# EAGLE schematic v1 (EAGLE 6.5.0)
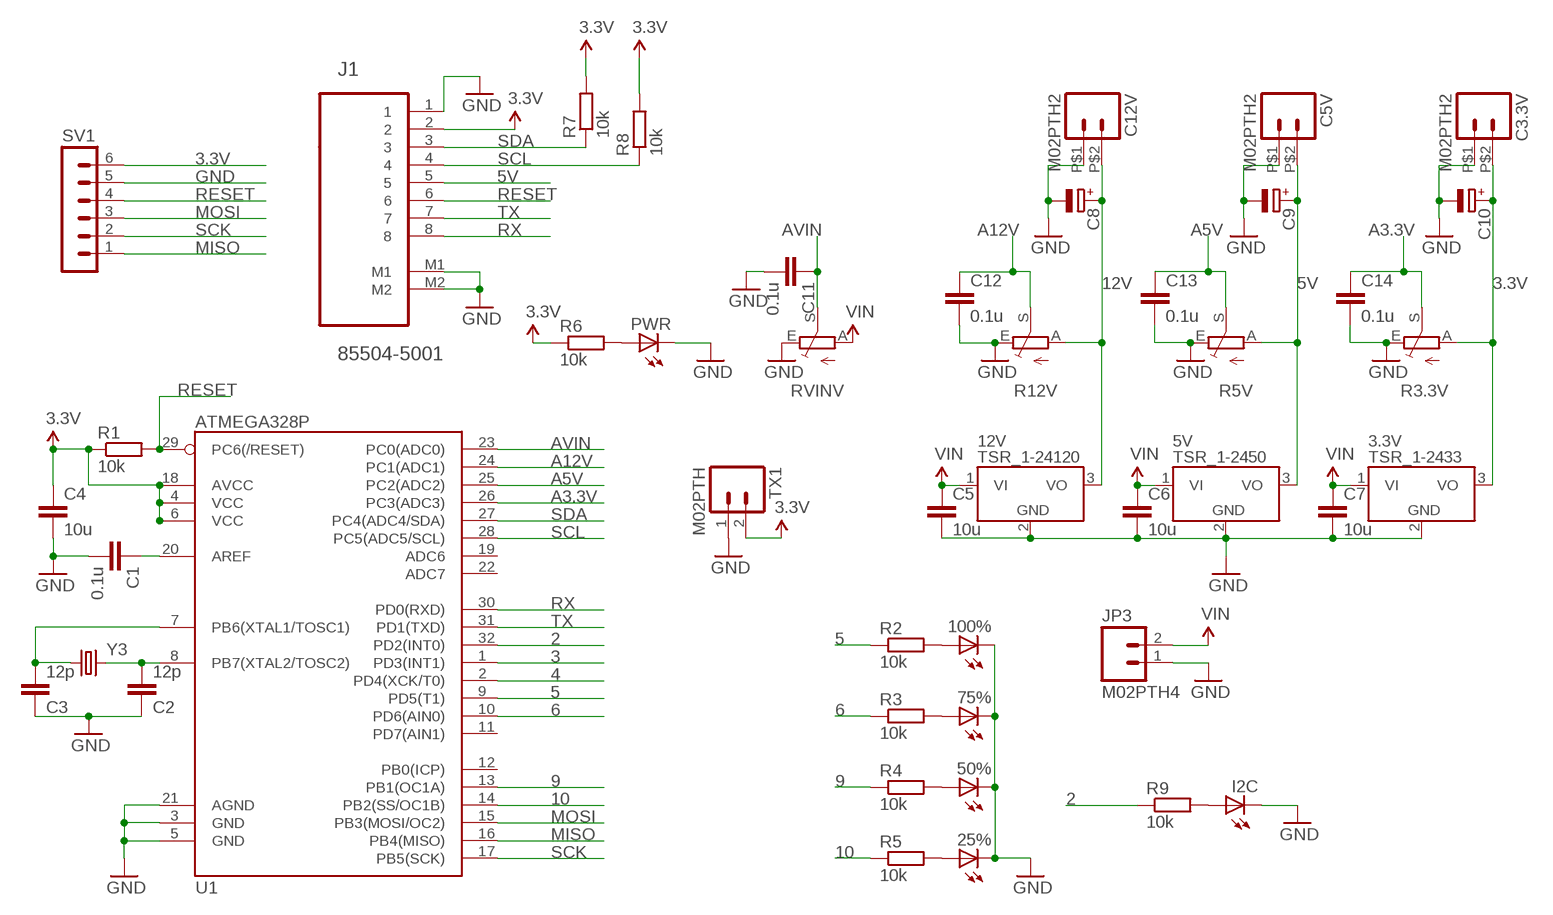
[diagram p0: schematic, sheet 1]

## Parts
3.3V  TSR_1-2433  [TSR-1]
5V  TSR_1-2450  [TSR-1]
12V  TSR_1-24120  [TSR-1]
25%  LEDSML0805  [SML0805]
50%  LEDSML0805  [SML0805]
75%  LEDSML0805  [SML0805]
100%  LEDSML0805  [SML0805]
C1  0.1u  C-EUC0805  [C0805]
C2  12p  C-EUC0805  [C0805]
C3  12p  C-EUC0805  [C0805]
C3.3V  M02PTH2  [1X02_BIG]
C4  10u  C-EUC0805  [C0805]
C5  10u  C-EUC0805  [C0805]
C5V  M02PTH2  [1X02_BIG]
C6  10u  C-EUC0805  [C0805]
C7  10u  C-EUC0805  [C0805]
C8  CPOL-EUE3.5-8  [E3,5-8]
C9  CPOL-EUE3.5-8  [E3,5-8]
C10  CPOL-EUE3.5-8  [E3,5-8]
C11  0.1u  C-EUC0805  [C0805]
C12  0.1u  C-EUC0805  [C0805]
C12V  M02PTH2  [1X02_BIG]
C13  0.1u  C-EUC0805  [C0805]
C14  0.1u  C-EUC0805  [C0805]
I2C  LEDSML0805  [SML0805]
J1  85504-5001  [MOLEX_85504-5001]
JP3  M02PTH4  [1X02_XTRA_BIG]
PWR  LEDSML0805  [SML0805]
R1  10k  R-EU_R0805  [R0805]
R2  10k  R-EU_R0805  [R0805]
R3  10k  R-EU_R0805  [R0805]
R3.3V  TRIM_EU-B64W  [B64W]
R4  10k  R-EU_R0805  [R0805]
R5  10k  R-EU_R0805  [R0805]
R5V  TRIM_EU-B64W  [B64W]
R6  10k  R-EU_R0805  [R0805]
R7  10k  R-EU_R0805  [R0805]
R8  10k  R-EU_R0805  [R0805]
R9  10k  R-EU_R0805  [R0805]
R12V  TRIM_EU-B64W  [B64W]
RVINV  TRIM_EU-B64W  [B64W]
SV1  MA06-1  [MA06-1]
TX1  M02PTH  [1X02]
U1  ATMEGA328P  ATMEGA328_SMT  [TQFP32-08]
Y3  CRYSTALCRYSTAL-SMD-5X3-LARGEPAD  [CRYSTAL-SMD-5X3]

## Nets
2: R9.1 U1.32(PD2(INT0))
3: U1.1(PD3(INT1))
3.3V: 3.3V.3(VO) C3.3V.P$2 C4.1 C10.+ J1.2 R1.1 R3.3V.A R6.1 R7.2 R8.2 SV1.6 TX1.2 U1.4(VCC) U1.6(VCC) U1.18(AVCC)
4: U1.2(PD4(XCK/T0))
5: R2.1 U1.9(PD5(T1))
5V: 5V.3(VO) C5V.P$2 C9.+ J1.5 R5V.A
6: R3.1 U1.10(PD6(AIN0))
9: R4.1 U1.13(PB1(OC1A))
10: R5.1 U1.14(PB2(SS/OC1B))
12V: 12V.3(VO) C8.+ C12V.P$2 R12V.A
A3.3V: C14.1 R3.3V.S U1.26(PC3(ADC3))
A5V: C13.1 R5V.S U1.25(PC2(ADC2))
A12V: C12.1 R12V.S U1.24(PC1(ADC1))
AVIN: C11.1 RVINV.S U1.23(PC0(ADC0))
GND: 3.3V.2(GND) 5V.2(GND) 12V.2(GND) 25%.C 50%.C 75%.C 100%.C C1.2 C2.1 C3.1 C3.3V.P$1 C4.2 C5.2 C5V.P$1 C6.2 C7.2 C8.- C9.- C10.- C11.2 C12.2 C12V.P$1 C13.2 C14.2 I2C.C J1.1 J1.M1 J1.M2 JP3.1 PWR.C R3.3V.E R5V.E R12V.E RVINV.E SV1.5 TX1.1 U1.3(GND) U1.5(GND) U1.21(AGND)
MISO: SV1.1 U1.16(PB4(MISO))
MOSI: SV1.3 U1.15(PB3(MOSI/OC2))
N$1: C1.1 U1.20(AREF)
N$2: I2C.A R9.2
N$3: C2.2 U1.8(PB7(XTAL2/TOSC2)) Y3.3
N$4: C3.2 U1.7(PB6(XTAL1/TOSC1)) Y3.1
N$7: 100%.A R2.2
N$8: 75%.A R3.2
N$9: 50%.A R4.2
N$10: 25%.A R5.2
N$11: PWR.A R6.2
RESET: J1.6 R1.2 SV1.4 U1.29(PC6(/RESET))
RX: J1.8 U1.30(PD0(RXD))
SCK: SV1.2 U1.17(PB5(SCK))
SCL: J1.4 R8.1 U1.28(PC5(ADC5/SCL))
SDA: J1.3 R7.1 U1.27(PC4(ADC4/SDA))
TX: J1.7 U1.31(PD1(TXD))
VIN: 3.3V.1(VI) 5V.1(VI) 12V.1(VI) C5.1 C6.1 C7.1 JP3.2 RVINV.A
Unconnected: U1.11(PD7(AIN1)) U1.12(PB0(ICP)) U1.19(ADC6) U1.22(ADC7)

## Library data of the parts
3.3V 5V 12V = _traco_tsr-1:TSR_1-*: TRACO TSR-1 Series Point-of-Load DC/DC-Converters Vi max. 36 V; Vo = (1.2 .. 15)V ±2%; Io = 0 .. 1 A SIP-Package (drop-in replacement for 78xx linear voltage regulators in TO220-package, vertically assembled) Source: www.tracopower.com Technologies: TSR 1- Vi (V) Vo (V) ±2% Io = 0 .. 1 A 24_ ( generic ) 2412 4.6 .. 36 1.2 2415 4.6 .. 36 1.5 2418 4.6 .. 36 1.8 2425 4.6 .. 36 2.5 2433 4.75.. 36 3.3 2450 6.5 .. 36 5.0 2465 9.0 .. 36 6.5 2490 12 .. 36 9.0 24120 15 .. 36 12 24150 18 .. 36 15 Author: Dipl.-Ing. FH Rainer Bayer HHN Hochschule Heilbronn, rainer.bayer@hs-heilbronn.de Ingenieurbüro ing-rb, mail@ing-rb.de
25% 50% 75% 100% I2C PWR = led:LED: LED OSRAM: - CHIPLED LG R971, LG N971, LY N971, LG Q971, LY Q971, LO R971, LY R971 LH N974, LH R974 LS Q976, LO Q976, LY Q976 LO Q996 - Hyper CHIPLED LW Q18S LB Q993, LB Q99A, LB R99A - SideLED LS A670, LO A670, LY A670, LG A670, LP A670 LB A673, LV A673, LT A673, LW A673 LH A674 LY A675 LS A676, LA A676, LO A676, LY A676, LW A676 LS A679, LY A679, LG A679 - Hyper Micro SIDELED® LS Y876, LA Y876, LO Y876, LY Y876 LT Y87S - SmartLED LW L88C, LW L88S LB L89C, LB L89S, LG L890 LS L89K, LO L89K, LY L89K LS L896, LA L896, LO L896, LY L896 - TOPLED LS T670, LO T670, LY T670, LG T670, LP T670 LSG T670, LSP T670, LSY T670, LOP T670, LYG T670 LG T671, LOG T671, LSG T671 LB T673, LV T673, LT T673, LW T673 LH T674 LS T676, LA T676, LO T676, LY T676, LB T676, LH T676, LSB T676, LW T676 LB T67C, LV T67C, LT T67C, LS T67K, LO T67K, LY T67K, LW E67C LS E67B, LA E67B, LO E67B, LY E67B, LB E67C, LV E67C, LT E67C LW T67C LS T679, LY T679, LG T679 LS T770, LO T770, LY T770, LG T770, LP T770 LB T773, LV T773, LT T773, LW T773 LH T774 LS E675, LA E675, LY E675, LS T675 LS T776, LA T776, LO T776, LY T776, LB T776 LHGB T686 LT T68C, LB T68C - Hyper Mini TOPLED® LB M676 - Mini TOPLED Santana® LG M470 LS M47K, LO M47K, LY M47K Source: http://www.osram.convergy.de LUXEON: - LUMILED® LXK2-PW12-R00, LXK2-PW12-S00, LXK2-PW14-U00, LXK2-PW14-V00 LXK2-PM12-R00, LXK2-PM12-S00, LXK2-PM14-U00 LXK2-PE12-Q00, LXK2-PE12-R00, LXK2-PE12-S00, LXK2-PE14-T00, LXK2-PE14-U00 LXK2-PB12-K00, LXK2-PB12-L00, LXK2-PB12-M00, LXK2-PB14-N00, LXK2-PB14-P00, LXK2-PB14-Q00 LXK2-PR12-L00, LXK2-PR12-M00, LXK2-PR14-Q00, LXK2-PR14-R00 LXK2-PD12-Q00, LXK2-PD12-R00, LXK2-PD12-S00 LXK2-PH12-R00, LXK2-PH12-S00 LXK2-PL12-P00, LXK2-PL12-Q00, LXK2-PL12-R00 Source: www.luxeon.com KINGBRIGHT: KA-3528ASYC Source: www.kingbright.com
C1-C7 C11-C14 = rcl:C-EU: CAPACITOR, European symbol
C3.3V C5V C12V JP3 TX1 = SparkFun-Connectors:M02: Standard 2-pin 0.1" header. Use with - straight break away headers ( PRT-00116) - right angle break away headers (PRT-00553) - swiss pins (PRT-00743) - machine pins (PRT-00117) - female headers (PRT-00115) Molex polarized connector foot print use with: PRT-08233 with associated crimp pins and housings. 2.54_SCREWTERM for use with PRT-10571. 3.5mm Screw Terminal footprints for PRT-08084 5mm Screw Terminal footprints for use with PRT-08433
C8-C10 = rcl:CPOL-EU: POLARIZED CAPACITOR, European symbol
J1 = Molex-8550x-xxxx:85504-5001: CONNECTOR, RJ45, JACK, 8P8C, 1PORT, CAT5; MPN: 85504-5001; OC_FARNELL: 2313732; OC_NEWARK: 96W3689; PACKAGE: RJ45, JACK, 8P8C; SUPPLIER: MOLEX
R1-R9 = rcl:R-EU_: RESISTOR, European symbol
R3.3V R5V R12V RVINV = pot:TRIM_EU-: POTENTIOMETER
SV1 = con-lstb:MA06-1: PIN HEADER; OC_FARNELL: unknown; OC_NEWARK: unknown
U1 = SparkFun-DigitalIC:ATMEGA328_SMT: 32-Pin Atmega328 part Commonly used on Arduino compatible boards Available in QFP and QFN packages TQFP is IC-09069 QFN is non-stock; PROD_ID: IC-09069
Y3 = SparkFun-FreqCtrl:CRYSTAL: Various standard crystals. Proven footprints. Spark Fun Electronics SKU : COM-00534